# Altium schematic sheet PD_MK2_S2.SchDoc: Sample Sheet Title
size B; Date: MM/DD/YYYY; Author: Sample Author; Organization: ORGANIZATION; Address1: ADDRESS 1; Address2: ADDRESS 2; Address3: ADDRESS 3; Address4: ADDRESS 4; Revision: -; SheetNumber: 2; SheetTotal: 2; ENG_APP_DATE: --/--/--; DSN_APP_DATE: --/--/--; CHK_APP_DATE: --/--/--
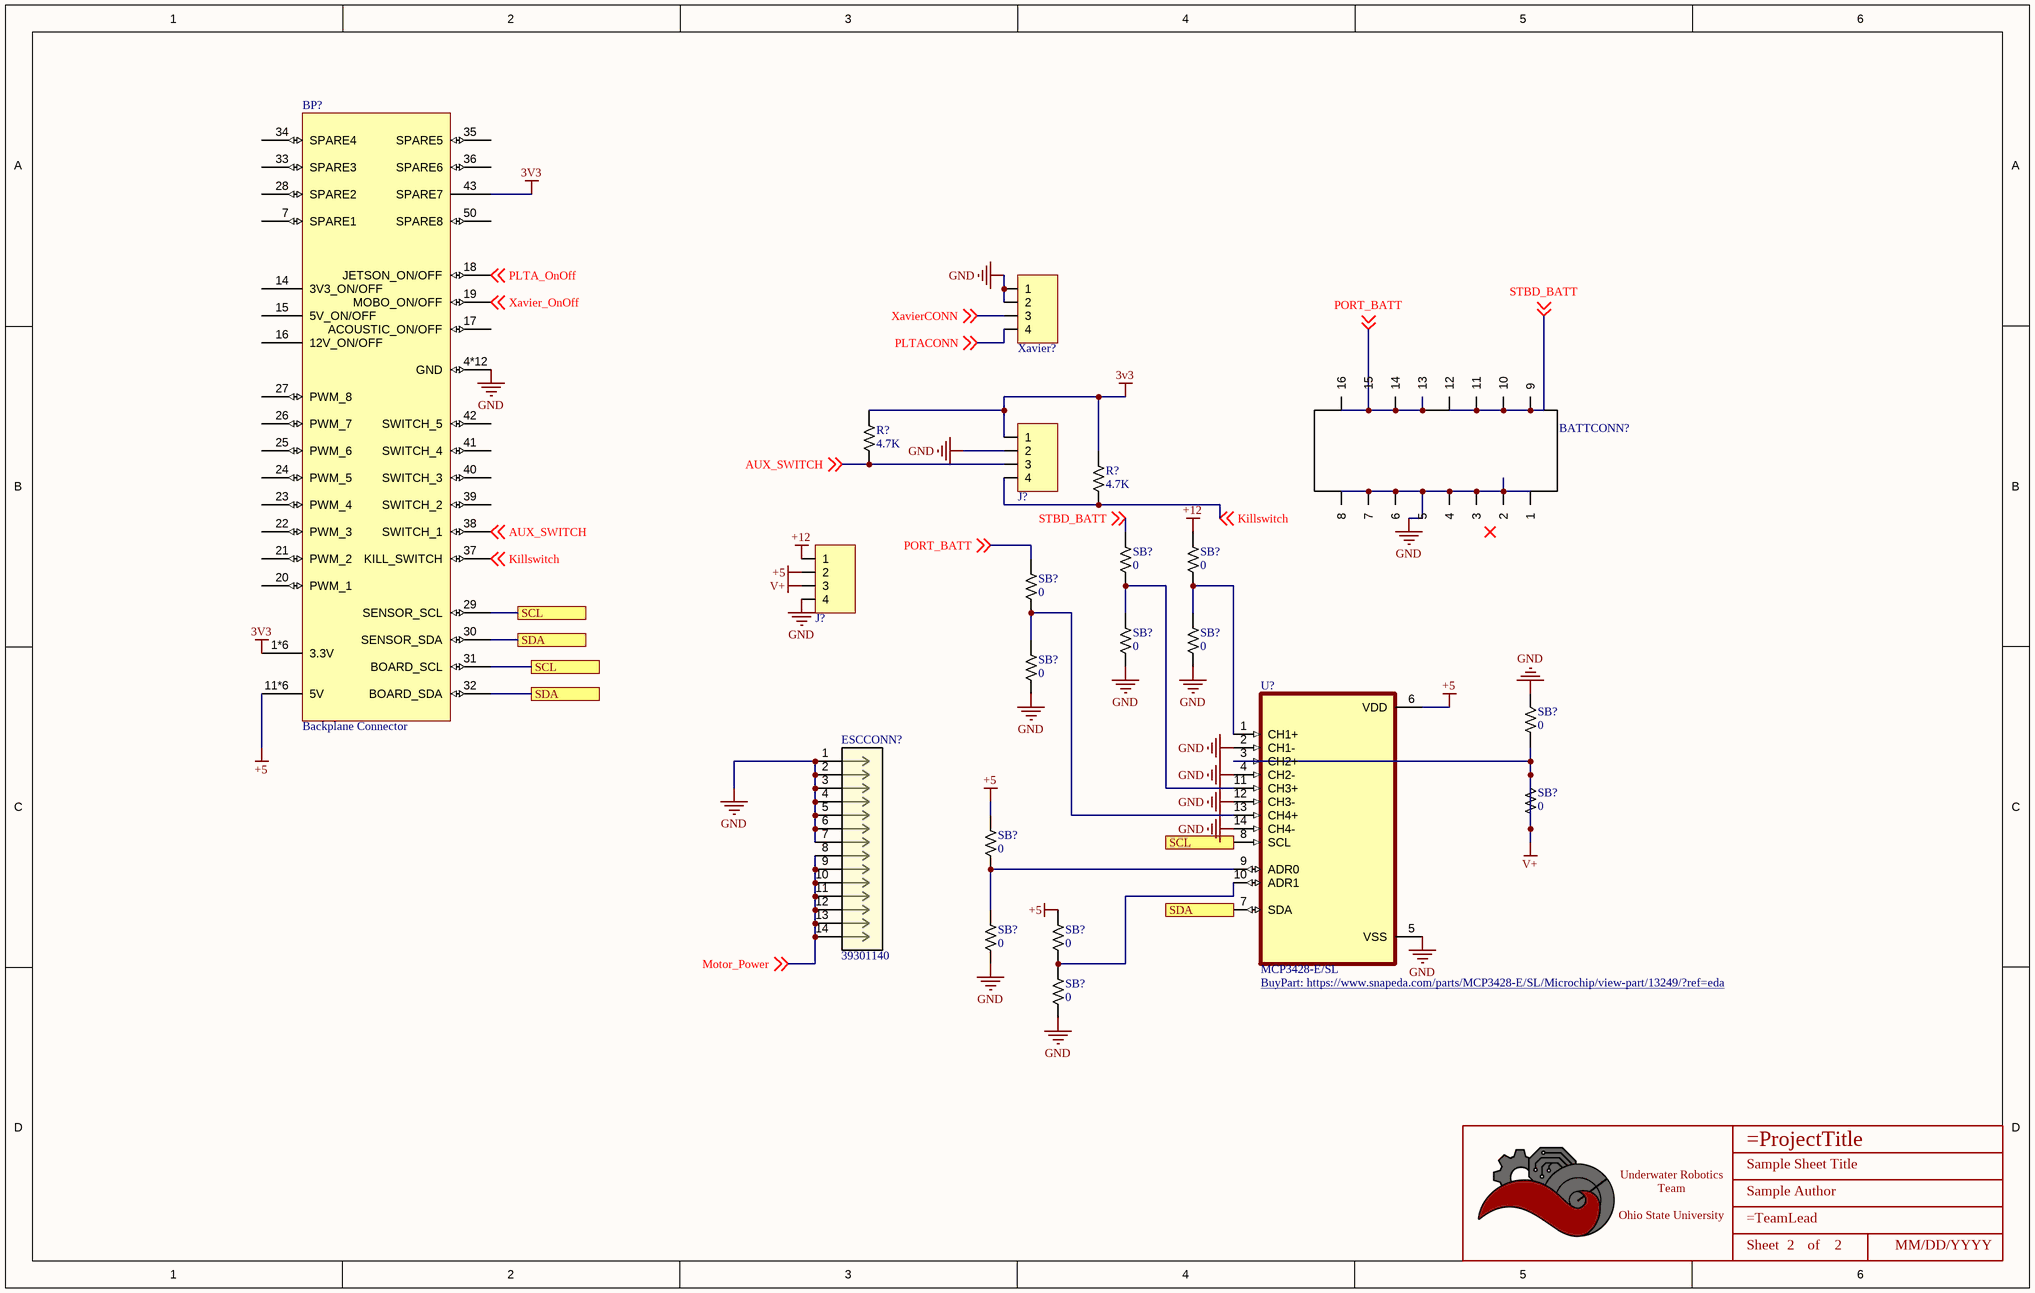
[diagram p0: PD_MK2_S2.SchDoc]

## Parts
(Parts that share a designator on the sheet are numbered #1, #2 ... from top to bottom, then left to right.)
*  Title_Block  [LOGO]  (value not drawn)  (graphical)
BATTCONN?  BatteryConnector  [CONN_MOLEX_MINIFIT JR_16 POS_R/A - duplicate]  (value not drawn)
BP?  Backplane Connector  [BACKPLANE_EDGE_CONN]
ESCCONN?  39301140  [CON_39301140]
J?#1  4 POS R/A  [CONN_MOLEX_MINIFIT JR_4 POS_R/A]  (value not drawn)
J?#2  4 POS R/A  [CONN_MOLEX_MINIFIT JR_4 POS_R/A]  (value not drawn)
R?#1  Value  (Ohms): 4.7K  [RESISTOR_0805]  (hidden comment: 4.7k Ohm 5% 1/8W)
R?#2  Value  (Ohms): 4.7K  [RESISTOR_0805]  (hidden comment: 4.7k Ohm 5% 1/8W)
SB?#1  Value  (Ohms): 0  [RESISTOR_0603]  (hidden comment: 0 Ohm Jumper No Fit)
SB?#2  Value  (Ohms): 0  [RESISTOR_0603]  (hidden comment: 0 Ohm Jumper No Fit)
SB?#3  Value  (Ohms): 0  [RESISTOR_0603]  (hidden comment: 0 Ohm Jumper No Fit)
SB?#4  Value  (Ohms): 0  [RESISTOR_0603]  (hidden comment: 0 Ohm Jumper No Fit)
SB?#5  Value  (Ohms): 0  [RESISTOR_0603]
SB?#6  Value  (Ohms): 0  [RESISTOR_0603]  (hidden comment: 0 Ohm Jumper No Fit)
SB?#7  Value  (Ohms): 0  [RESISTOR_0603]  (hidden comment: 0 Ohm Jumper No Fit)
SB?#8  Value  (Ohms): 0  [RESISTOR_0603]  (hidden comment: 0 Ohm Jumper No Fit)
SB?#9  Value  (Ohms): 0  [RESISTOR_0603]  (hidden comment: 0 Ohm Jumper No Fit)
SB?#10  Value  (Ohms): 0  [RESISTOR_0603]  (hidden comment: 0 Ohm Jumper No Fit)
SB?#11  Value  (Ohms): 0  [RESISTOR_0603]  (hidden comment: 0 Ohm Jumper No Fit)
SB?#12  Value  (Ohms): 0  [RESISTOR_0603]  (hidden comment: 0 Ohm Jumper No Fit)
U?  MCP3428-E/SL  [SOIC127P600X175-14N]
Xavier?  4 POS R/A  [CONN_MOLEX_MINIFIT JR_4 POS_R/A]  (value not drawn)

## Ports
SCL, SDA

## Nets
3V3: BP?.1*6(3.3V) BP?.43(SPARE7) J?#1.1 R?#1.1 R?#2.1
+5: BP?.11*6(5V) J?#2.2 SB?#9.1 SB?#11.1 U?.6(VDD)
+12: J?#2.1 SB?#2.1
GND: BATTCONN?.1 BATTCONN?.2 BATTCONN?.3 BATTCONN?.4 BATTCONN?.5 BATTCONN?.6 BATTCONN?.7 BATTCONN?.8 BP?.4*12(GND) ESCCONN?.1 ESCCONN?.2 ESCCONN?.3 ESCCONN?.4 ESCCONN?.5 ESCCONN?.6 ESCCONN?.7 J?#1.2 J?#2.4 SB?#4.2 SB?#5.2 SB?#6.2 SB?#7.2 SB?#10.2 SB?#12.2 U?.2(CH1-) U?.4(CH2-) U?.5(VSS) U?.12(CH3-) U?.14(CH4-) Xavier?.1 Xavier?.2
V+: J?#2.3 SB?#7.1 SB?#8.1 SB?#8.2 U?.3(CH2+)
AUX_SWITCH: BP?.38(SWITCH_1) J?#1.3 R?#1.2 ; off-sheet AUX_SWITCH
Killswitch: BP?.37(KILL_SWITCH) J?#1.4 R?#2.2 ; off-sheet Killswitch
Motor_Power: ESCCONN?.8 ESCCONN?.9 ESCCONN?.10 ESCCONN?.11 ESCCONN?.12 ESCCONN?.13 ESCCONN?.14 ; off-sheet Motor_Power
PLTA_OnOff: BP?.18(JETSON_ON/OFF) ; off-sheet PLTA_OnOff
PLTACONN: Xavier?.4 ; off-sheet PLTACONN
PORT_BATT: BATTCONN?.13 BATTCONN?.14 BATTCONN?.15 BATTCONN?.16 SB?#3.1 ; off-sheet PORT_BATT
SCL: BP?.29(SENSOR_SCL) BP?.31(BOARD_SCL) U?.8(SCL) ; port SCL
SDA: BP?.30(SENSOR_SDA) BP?.32(BOARD_SDA) U?.7(SDA) ; port SDA
STBD_BATT: BATTCONN?.9 BATTCONN?.10 BATTCONN?.11 BATTCONN?.12 SB?#1.1 ; off-sheet STBD_BATT
Xavier_OnOff: BP?.19(MOBO_ON/OFF) ; off-sheet Xavier_OnOff
XavierCONN: Xavier?.3 ; off-sheet XavierCONN
NetSB?#1_2: SB?#1.2 SB?#4.1 U?.11(CH3+)
NetSB?#2_2: SB?#2.2 SB?#5.1 U?.1(CH1+)
NetSB?#3_2: SB?#3.2 SB?#6.1 U?.13(CH4+)
NetSB?#9_2: SB?#9.2 SB?#10.1 U?.9(ADR0)
NetSB?#11_2: SB?#11.2 SB?#12.1 U?.10(ADR1)

Not connected (* = marked no-connect by the designer): BP? 7(SPARE1) 14(3V3_ON/OFF) 15(5V_ON/OFF) 16(12V_ON/OFF) 17(ACOUSTIC_ON/OFF) 20(PWM_1) 21(PWM_2) 22(PWM_3) 23(PWM_4) 24(PWM_5) 25(PWM_6) 26(PWM_7) 27(PWM_8) 28(SPARE2) 33(SPARE3) 34(SPARE4) 35(SPARE5) 36(SPARE6) 39(SWITCH_2) 40(SWITCH_3) 41(SWITCH_4) 42(SWITCH_5) 50(SPARE8)

## Notes on the sheet
- DWG. NO.
- REV.
- SHT.
- THIS DOCUMENT AND THE DATA DISCLOSED HEREIN OR HEREWITH IS THE PROPERTY OF ALTIUM LIMITED AND MAY BE FREELY DISTRIBUTED IN WHOLE. NO RIGHTS ARE RESERVED OR EXPRESS OR IMPLIED WARANTEE GIVEN.
- REVISION
- DESCRIPTION
- DATE
- APPROVED
- ENG:
- APPROVALS
- PROJECT
- DSN:
- CHK:
- REFERENCE DOCUMENTS
- PROJECT REVISION:
- TITLE
- DOCUMENT REVISION:
- DESIGN ITEM:
- BOM:
- FAB DWG:
- PCB DWG:
- ASSY DWG:
- SCALE:
- SIZE
- B
- CAGE CODE
- FILE NAME
- DWG NO.
- SHEET
- OF
- REV
- (in symbol Title_Block) Underwater Robotics Team / Ohio State University; Sheet; of

## Library data of the parts
* = Title_Block: UWRT Schematic Title Block Template / Created June 2021, Dylan Trainor
BP? = BACKPLANE_EDGE_CONN: Titan Backplane Edge Connector; pin to pad: 1*6>1+2+3+54+55+56 4*12>4+5+6+8+9+10+47+48+49+51+52+53 11*6>11+12+13+44+45+46
ESCCONN? = 39301140: No Description Available; Mfr_Name: Molex Connector Corporation; Copyright: Copyright (C) 2022 Ultra Librarian. All rights reserved.; Manufacturer_Part_Number: 39301140; RefDes: RefDes; Type: DEV
J?#1 J?#2 Xavier? = CONN_MOLEX_MINIFIT JR_4POS_R/A: Molex Minifit Jr. 5569 / 4 Pos R/A Natural; Pitch: 4.2mm; Configuration: Right Angle; Current Per Pin: 13A; Number of Positions: 4; Supplier Part Number 1: WM13112-ND; Supplier 1: Digi-Key; Manufacturer: Molex; Color: Natural; Created By: Flip B; ComponentLink1Description: Datasheet; ComponentLink1URL: https://www.molex.com/pdm_docs/sd/026013115_sd.pdf; Series: Minifit Jr 5569
R?#1 R?#2 = RESISTOR_4.7K_0805: RES 4.7k OHM 5% 1/8W 0805; Tolerance: +/- 5%; Made By: Robert Pafford; ComponentLink1Description: Datasheet; Wattage: 1/8W; Supplier: Digikey; Digikey Part Numer: CR0603-JW-104ELFTR-ND
SB?#1-SB?#12 = JUMPER_0_0603: 0 Ohm Jumper No Fit for Solder Bridge; Made By: Robert Pafford; ComponentLink1Description: Digikey; ComponentLink1URL: https://www.digikey.com/en/products/detail/koa-speer-electronics-inc/RK73B1JTTD101J/9844701
U? = MCP3428-E/SL: 16 Bit Analog to Digital Converter 4 Input 1 Sigma-Delta 14-SOIC; MF: Microchip; Package: SOIC-14 Microchip; SnapEDA_Link: https://www.snapeda.com/parts/MCP3428-E/SL/Microchip/view-part/13249/?ref=snap; MP: MCP3428-E/SL; Price: None; Availability: Unavailable; Value: *; BuyPart: https://www.snapeda.com/parts/MCP3428-E/SL/Microchip/view-part/13249/?ref=eda